# Altium schematic sheet 8_USB power + Data.schdoc
size 497 x 243 mm; Name: A_A4; Symbol: A_A4; Device: A_A4; @Project Name: TUD-EnergyHarvestingConsole_2022-08-29_17-01-09; REV: 1.0; Date: 2022-07-06; Sheet: 1/1; Draw By: Alejandro Cabrerizo; Convert to PCB: yes; Add into BOM: yes
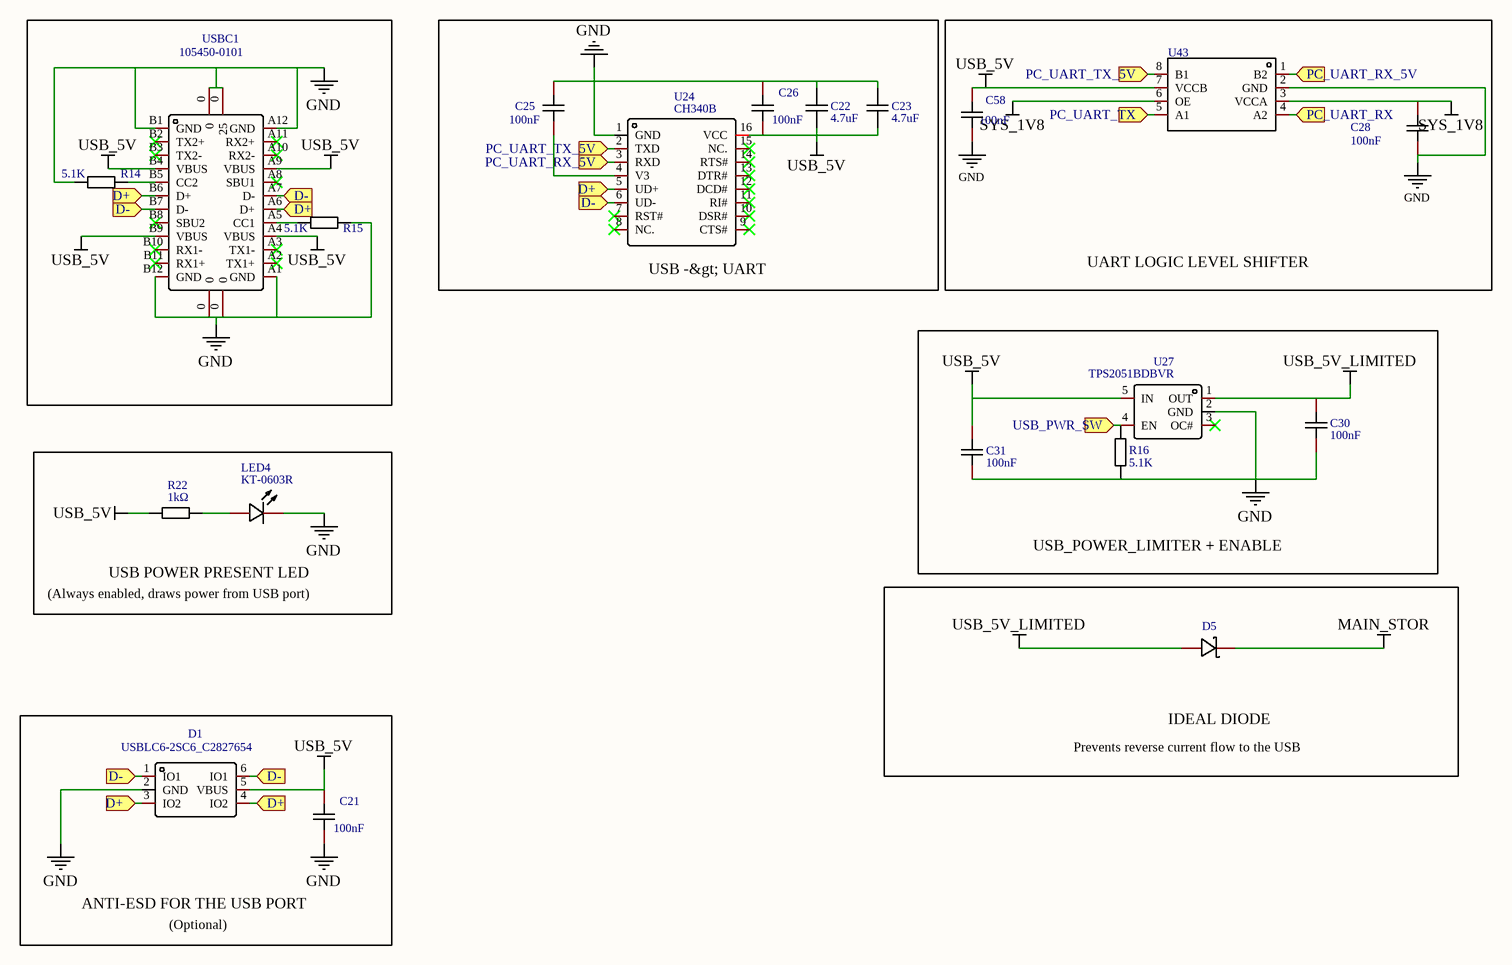
[diagram p0: 8_USB power + Data.schdoc]

## Parts
C21  100nF  [C0603]
C22  4.7uF  [C0603]
C23  4.7uF  [C0603]
C25  100nF  [C0603]
C26  100nF  [C0603]
C28  100nF  [C0603]
C30  100nF  [C0603]
C31  100nF  [C0603]
C58  100nF  [C0603]
D1  USBLC6-2SC6_C2827654  [SOT-23-6_L2.9-W1.6-P0.95-LS2.8-BL]
D5  SS54  [SMA_L4.4-W2.8-LS5.4-R-RD]  (value not drawn)
LED4  KT-0603R  [LED0603-R-RD]
R14  5.1K  [R0603]
R15  5.1K  [R0603]
R16  5.1K  [R0603]
R22  1kΩ  [R0603]
U24  CH340B  [SOIC-16_L9.9-W3.9-P1.27-LS6.0-BL]
U27  TPS2051BDBVR  [SOT-23-5_L3.0-W1.7-P0.95-LS2.8-BR]
U43  TXS0102DCUR  [US-8_L2.4-W2.1-P0.50-LS3.2-BR]  (value not drawn)
USBC1  105450-0101  [USB-C-SMD_TYPE-C-USB-18]

## Blocks framed on the sheet
USB -&gt; UART: C22 C23 C25 C26 U24
UART LOGIC LEVEL SHIFTER: C28 C58 U43
USB_POWER_LIMITER + ENABLE: C30 C31 R16 U27
USB POWER PRESENT LED: LED4 R22
IDEAL DIODE: D5
ANTI-ESD FOR THE USB PORT: C21 D1

## Ports
D+ (in), D- (in), PC_UART_RX (in), PC_UART_RX_5V (in), PC_UART_TX (in), PC_UART_TX_5V (in), USB_PWR_SW (in)

## Nets
GND: C21.1 C22.2 C23.2 C25.2 C26.2 C28.2 C30.2 C31.2 C58.2 D1.2(GND) LED4.2(K) R14.1 R15.2 R16.1 U24.1(GND) U27.2(GND) U43.2(GND) USBC1.0 USBC1.A1(GND) USBC1.A12(GND) USBC1.B1(GND) USBC1.B12(GND)
MAIN_STOR: D5.2(K)
SYS_1V8: C28.1 U43.3(VCCA) U43.6(OE)
USB_5V: C21.2 C22.1 C23.1 C26.1 C31.1 C58.1 D1.5(VBUS) R22.1 U24.16(VCC) U27.5(IN) U43.7(VCCB) USBC1.A4(VBUS) USBC1.A9(VBUS) USBC1.B4(VBUS) USBC1.B9(VBUS)
USB_5V_LIMITED: C30.1 D5.1(A) U27.1(OUT)
D+: D1.3(IO2) D1.4(IO2) U24.5(UD+) USBC1.A6(D+) USBC1.B6(D+) ; port D+
D-: D1.1(IO1) D1.6(IO1) U24.6(UD-) USBC1.A7(D-) USBC1.B7(D-) ; port D-
PC_UART_RX: U43.4(A2) ; port PC_UART_RX
PC_UART_RX_5V: U24.3(RXD) U43.1(B2) ; port PC_UART_RX_5V
PC_UART_TX: U43.5(A1) ; port PC_UART_TX
PC_UART_TX_5V: U24.2(TXD) U43.8(B1) ; port PC_UART_TX_5V
USB_PWR_SW: R16.2 U27.4(EN) ; port USB_PWR_SW
NetC25_1: C25.1 U24.4(V3)
NetLED4_1: LED4.1(A) R22.2
NetR14_2: R14.2 USBC1.B5(CC2)
NetR15_1: R15.1 USBC1.A5(CC1)

Not connected (* = marked no-connect by the designer): U24 7(RST#)* 8(NC.)* 9(CTS#)* 10(DSR#)* 11(RI#)* 12(DCD#)* 13(DTR#)* 14(RTS#)* 15(NC.)*; U27 3(OC#)*; USBC1 A2(TX1+)* A3(TX1-)* A8(SBU1)* A10(RX2-)* A11(RX2+)* B2(TX2+)* B3(TX2-)* B8(SBU2)* B10(RX1-)* B11(RX1+)*

## Notes on the sheet
- (Always enabled, draws power from USB port)
- Prevents reverse current flow to the USB
- (Optional)
- 1
- 2
- 3
- 4
- 5
- A
- B
- C
- D
- TITLE:
- TUD-EnergyHarvestingConsole_2022-08-29_17-01-09
- REV:
- 1.0
- Date:
- Company:
- 2022-07-06
- Drawn By:
- Alejandro Cabrerizo
- Sheet:
- 1/1

## Library data of the parts
C21 C25 C26 C28 C30 C31 C58 = CC0603KRX7R9BB104: Manufacturer: YAGEO; Convert to PCB: yes; Name: 100nF; Symbol: 100nF; Device: CC0603KRX7R9BB104; Supplier: LCSC; Manufacturer Part: CC0603KRX7R9BB104; Supplier Part: C14663; JLCPCB Part Class: Basic; Add into BOM: yes; Origin Footprint: C0603
C22 C23 = CL10A475KO8NNNC: Manufacturer: SAMSUNG; Convert to PCB: yes; Name: 4.7uF; Symbol: 4.7uF; Device: CL10A475KO8NNNC; Supplier: LCSC; Manufacturer Part: CL10A475KO8NNNC; Supplier Part: C19666; JLCPCB Part Class: Basic Part; Add into BOM: yes; Origin Footprint: C0603
D1 = USBLC6-2SC6: Manufacturer: TECH PUBLIC(台舟电子); Convert to PCB: yes; Name: USBLC6-2SC6_C2827654; Symbol: USBLC6-2SC6_C2827654; Device: USBLC6-2SC6; Supplier: LCSC; Supplier Part: C2827654; Manufacturer Part: USBLC6-2SC6; JLCPCB Part Class: Extended Part; Add into BOM: yes; Origin Footprint: SOT-23-6_L2.9-W1.6-P0.95-LS2.8-BL
D5 = SS54: Reverse Voltage (Vr):40V Average Rectified Current (Io):5A Forward Voltage (Vf@If):550mV@5A; Manufacturer: MDD; Symbol: SS54_C22452; Add into BOM: yes; Reverse Voltage (Vr): 40V; Average Rectified Current (Io): 5A; Device: SS54; LCSC Part Name: 40V 5A 550mV@5A; Supplier Part: C22452; Manufacturer Part: SS54; Supplier Footprint: SMA(DO-214AC); JLCPCB Part Class: Basic Part; Datasheet: https://atta.szlcsc.com/upload/public/pdf/source/20190306/C22452_DC5E4F74C3B638F6D8E4C7650D5BF30E.pdf; Supplier: LCSC; Convert to PCB: yes; Forward Voltage (Vf@If): 550mV@5A
LED4 = KT-0603R: Manufacturer: KENTO; Convert to PCB: yes; Name: KT-0603R; Symbol: KT-0603R; Device: KT-0603R; Supplier: LCSC; Manufacturer Part: KT-0603R; Supplier Part: C2286; JLCPCB Part Class: Basic Part; Add into BOM: yes; Origin Footprint: LED0603-R-RD
R14-R16 = 0603WAF5101T5E: Manufacturer: UniOhm; Convert to PCB: yes; Name: 5.1K; Symbol: 5.1K; Device: 0603WAF5101T5E; Supplier: LCSC; Manufacturer Part: 0603WAF5101T5E; Supplier Part: C23186; JLCPCB Part Class: Basic; Add into BOM: yes; Origin Footprint: R0603
R22 = 0603WAF1001T5E: Manufacturer: UniOhm; Resistance: 1K; Convert to PCB: yes; Name: 1kΩ; Symbol: 1kΩ; Device: 0603WAF1001T5E; Supplier: LCSC; Manufacturer Part: 0603WAF1001T5E; Supplier Part: C21190; JLCPCB Part Class: Basic Part; Add into BOM: yes; Origin Footprint: R0603
U24 = CH340B: Manufacturer: WCH; Convert to PCB: yes; Name: CH340B; Symbol: CH340B; Device: CH340B; Supplier: LCSC; Manufacturer Part: CH340B; Supplier Part: C81010; JLCPCB Part Class: Extended Part; Add into BOM: yes; Origin Footprint: SOIC-16_L9.9-W3.9-P1.27-LS6.0-BL
U27 = TPS2051BDBVR: Manufacturer: TI; Convert to PCB: yes; Name: TPS2051BDBVR; Symbol: TPS2051BDBVR; Device: TPS2051BDBVR; Supplier: LCSC; Manufacturer Part: TPS2051BDBVR; Supplier Part: C24593; JLCPCB Part Class: Extended Part; Add into BOM: yes; Origin Footprint: SOT-23-5_L3.0-W1.7-P0.95-LS2.8-BR
U43 = TXS0102DCUR: Translator Type:Voltage Levels Channel Type:Bi-Directional Number of Circuits:1 Channels per Circuit:2 Supply Voltage (VCCA):1.65V~3.6V Supply Voltage (VCCB):2.3V~5.5V Input Signal:- Output Signal:- Output Type:Open Drain，Push-pull Data Rate:24Mbps Operat; Manufacturer: TI(德州仪器); Add into BOM: yes; Number of Circuits: 1; Channels per Circuit: 2; Data Rate: 24Mbps; Symbol: TXS0102DCUR; Device: TXS0102DCUR; LCSC Part Name: TXS0102DCUR; Supplier Part: C53434; Manufacturer Part: TXS0102DCUR; Supplier Footprint: VSSOP-8; JLCPCB Part Class: Extended Part; Datasheet: https://atta.szlcsc.com/upload/public/pdf/source/20150713/1457707330008.pdf; Supplier: LCSC; Convert to PCB: yes; Translator Type: Voltage Levels; Channel Type: Bi-Directional; Supply Voltage (VCCA): 1.65V~3.6V; Supply Voltage (VCCB): 2.3V~5.5V; Input Signal: -; Output Signal: -; Output Type: Open Drain，Push-pull; Operating Temperature: -40~+85; Features: 自动方向检测
USBC1 = 105450-0101: Manufacturer: MOLEX; Convert to PCB: yes; Name: 105450-0101; Symbol: 105450-0101; Device: 105450-0101; Supplier: LCSC; Supplier Part: C134092; Manufacturer Part: 105450-0101; JLCPCB Part Class: Extended Part; Add into BOM: yes; Origin Footprint: USB-C-SMD_TYPE-C-USB-18